# EAGLE design Collection 1 (EAGLE 9.6.2)
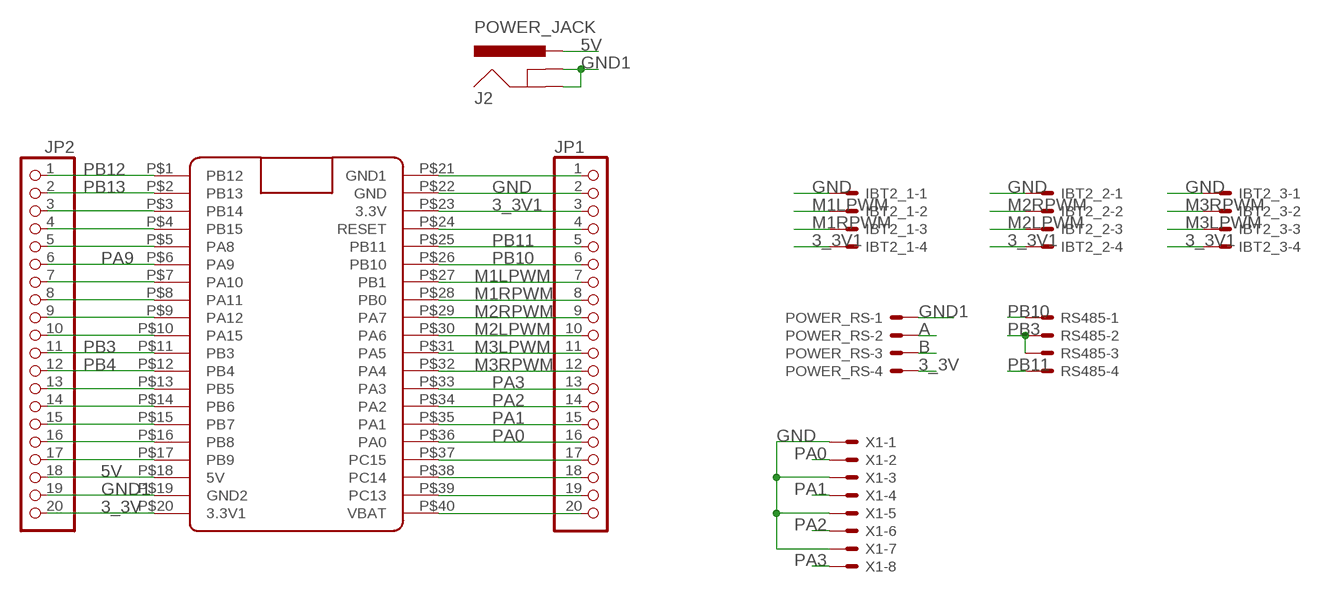
[diagram p0: schematic, sheet 1]

## Parts
IBT2_1  JST-XH-04-PIN-LONG-PAD  [JST-XH-04-PACKAGE-LONG-PAD]
IBT2_2  JST-XH-04-PIN-LONG-PAD  [JST-XH-04-PACKAGE-LONG-PAD]
IBT2_3  JST-XH-04-PIN-LONG-PAD  [JST-XH-04-PACKAGE-LONG-PAD]
J2  POWER_JACK  [POWER_JACK]
JP1  PINHD-1X20  [1X20]
JP2  PINHD-1X20  [1X20]
POWER_RS  JST-XH-04-PIN-LONG-PAD  [JST-XH-04-PACKAGE-LONG-PAD]
RS485  JST-XH-04-PIN-LONG-PAD  [JST-XH-04-PACKAGE-LONG-PAD]
U$1  BLUE_PILL  [BLUE_PILL]
X1  JST-XH-08-PIN-LONG-PAD  [JST-XH-08-PACKAGE-LONG-PAD]

## Nets
3_3V: JP2.20 POWER_RS.4 U$1.P$20(3.3V1)
3_3V1: IBT2_1.4 IBT2_2.4 IBT2_3.4 JP1.3 U$1.P$23(3.3V)
5V: J2.PWR JP2.18 U$1.P$18(5V)
A: POWER_RS.2
B: POWER_RS.3
GND: IBT2_1.1 IBT2_2.1 IBT2_3.1 JP1.2 U$1.P$22(GND) X1.1 X1.3 X1.5 X1.7
GND1: J2.GND J2.GNDBREAK JP2.19 POWER_RS.1 U$1.P$19(GND2)
M1LPWM: IBT2_1.2 JP1.7 U$1.P$27(PB1)
M1RPWM: IBT2_1.3 JP1.8 U$1.P$28(PB0)
M2LPWM: IBT2_2.3 JP1.10 U$1.P$30(PA6)
M2RPWM: IBT2_2.2 JP1.9 U$1.P$29(PA7)
M3LPWM: IBT2_3.3 JP1.11 U$1.P$31(PA5)
M3RPWM: IBT2_3.2 JP1.12 U$1.P$32(PA4)
N$1: JP2.10 U$1.P$10(PA15)
N$2: JP2.7 U$1.P$7(PA10)
N$3: JP2.3 U$1.P$3(PB14)
N$4: JP2.4 U$1.P$4(PB15)
N$5: JP2.5 U$1.P$5(PA8)
N$13: JP2.8 U$1.P$8(PA11)
N$14: JP2.9 U$1.P$9(PA12)
N$18: JP2.13 U$1.P$13(PB5)
N$19: JP2.14 U$1.P$14(PB6)
N$20: JP2.15 U$1.P$15(PB7)
N$21: JP2.16 U$1.P$16(PB8)
N$22: JP2.17 U$1.P$17(PB9)
N$24: JP1.1 U$1.P$21(GND1)
N$29: JP1.4 U$1.P$24(RESET)
N$46: JP1.17 U$1.P$37(PC15)
N$47: JP1.18 U$1.P$38(PC14)
N$48: JP1.19 U$1.P$39(PC13)
N$49: JP1.20 U$1.P$40(VBAT)
PA0: JP1.16 U$1.P$36(PA0) X1.2
PA1: JP1.15 U$1.P$35(PA1) X1.4
PA2: JP1.14 U$1.P$34(PA2) X1.6
PA3: JP1.13 U$1.P$33(PA3) X1.8
PA9: JP2.6 U$1.P$6(PA9)
PB3: JP2.11 RS485.2 RS485.3 U$1.P$11(PB3)
PB4: JP2.12 U$1.P$12(PB4)
PB10: JP1.6 RS485.1 U$1.P$26(PB10)
PB11: JP1.5 RS485.4 U$1.P$25(PB11)
PB12: JP2.1 U$1.P$1(PB12)
PB13: JP2.2 U$1.P$2(PB13)

## Library data of the parts
IBT2_1-IBT2_3 POWER_RS RS485 = JST:JST-XH-04-PIN: JST XH Connector 2 Pin Wire to board connector. Pitch: 2,54 mm, (0.100") Number of pins: 4 Created by Rembrandt Electronics www.rembrandtelectronics.com
J2 = J-Generic-5.5mm-Barrel-Jack:POWER_JACK: Power Jack Connector This is the standard 5.5mm barrel jack for power. The PTH is the most common, proven, reliable, footprint. The Slot footprint only works if the mill layer is transmitted to the PCB fab house so be warned. Here are the connectors we sell at SparkFun: DC Barrel Power Jack/Connector <https://www.sparkfun.com/products/119> (PRT-00119) DC Barrel Power Jack/Connector (SMD) <https://www.sparkfun.com/products/12748> (PRT-12748) DC Barrel Jack Adapter - Breadboard Compatible <https://www.sparkfun.com/products/10811> (PRT-10811) It is used on this SparkFun product (and many, many others): SparkFun RedBoard - Programmed with Arduino <https://www.sparkfun.com/products/12757> (DEV-12757) Also, if you need a mating power supply or connector, please check these out: Wall Adapter Power Supply - 9VDC 650mA <https://www.sparkfun.com/products/298> (TOL-00298) DC Barrel Jack Adapter - Male <https://www.sparkfun.com/products/10287> (PRT-10287); DPN: CP-202A-ND; MPN: PJ-202A
JP1 JP2 = pinhead:PINHD-1X20: PIN HEADER
U$1 = BluePill:BLUE_PILL
X1 = JST:JST-XH-08-PIN: JST XH Connector 2 Pin Wire to board connector. Pitch: 2,54 mm, (0.100") Number of pins: 8 Created by Rembrandt Electronics www.rembrandtelectronics.com

## Net classes
0 default: width 0.3 mm, drill 0.203 mm, clearance 0.3 mm
1 Power: width 1.2 mm, drill 0.305 mm, clearance 0.3 mm

## Board
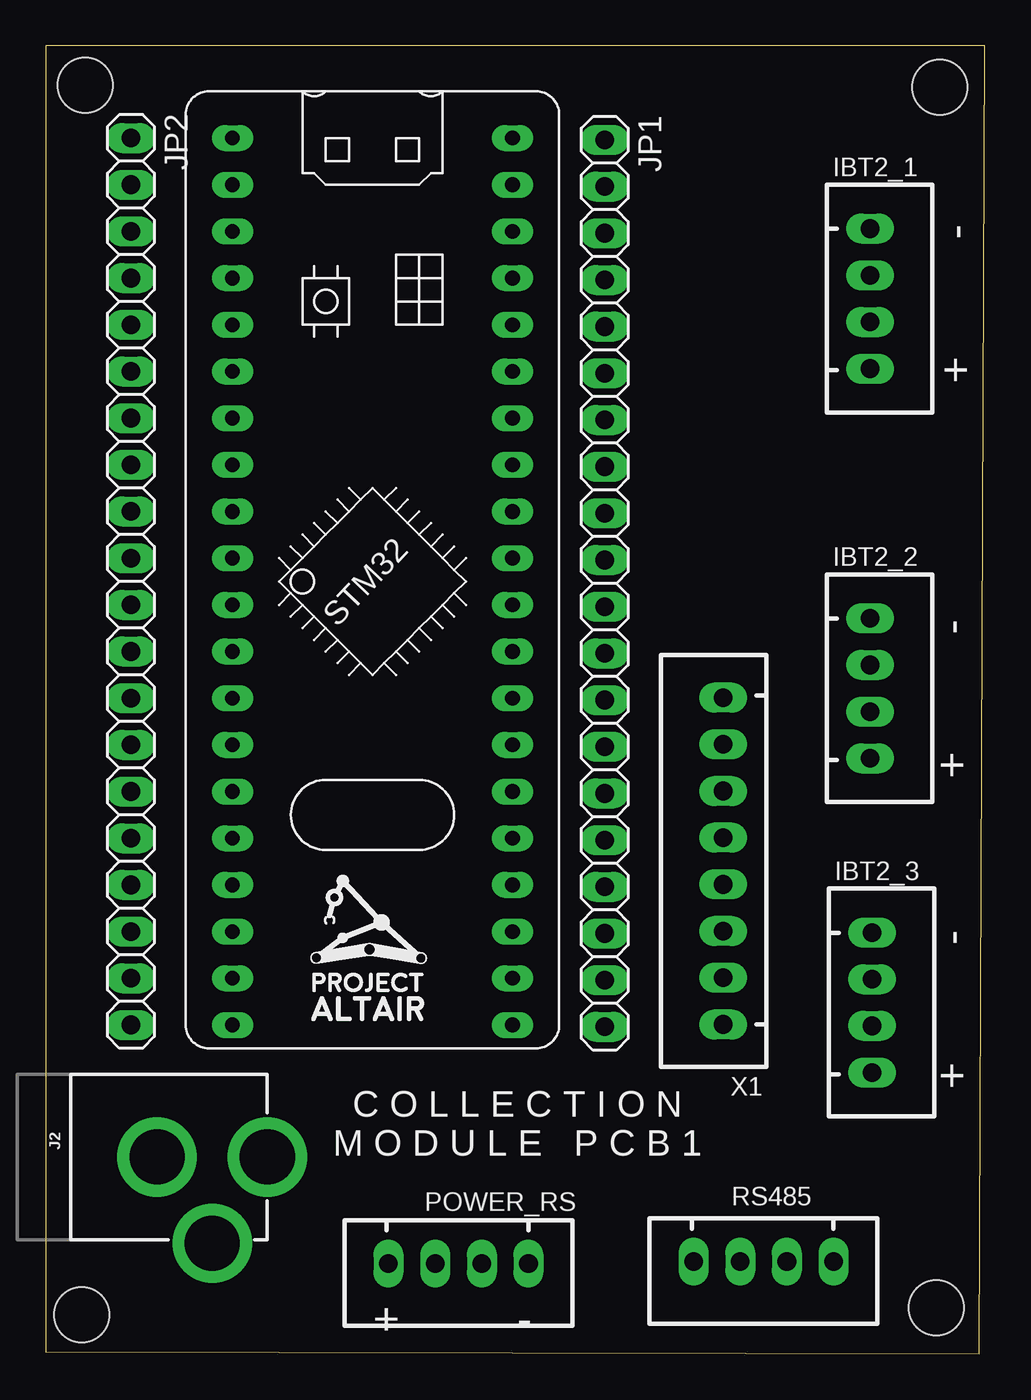
[diagram p1: board, top side]
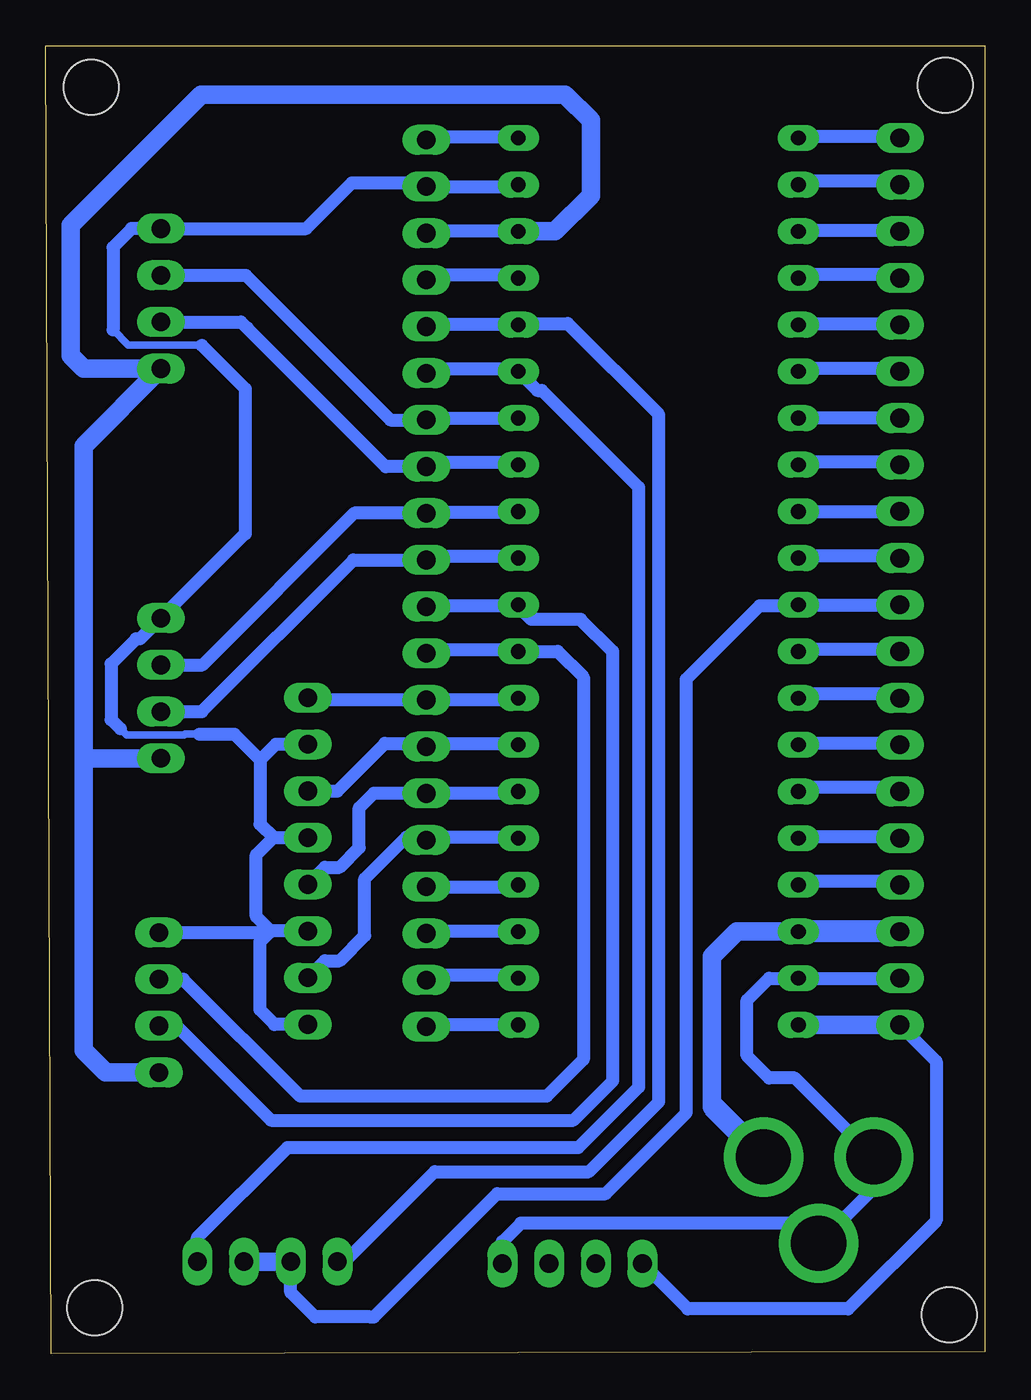
[diagram p2: board, bottom side, seen from below]

Size 51.1 x 71.15 mm. Coordinates in mm from the lower left corner, seen from the top.
Outline: 0,0.1 50.8,0 51.1,71.15 0,71.15 0,0.1
Copper layers (1*16): Top 0.035mm / dielectric 1.5mm / Bottom 0.035mm
Design rules "default *": minimum track width 0.3mm, minimum drill 0.65mm, track to track 0.3mm, track to pad 0.3mm, pad to pad 0.5mm, via to via 0.5mm, smd to smd 30mil, copper to edge 0.7mm, drill to drill 15mil, minimum pad ring 12mil, minimum via ring 15mil, stop-mask expansion 4mil, vias tented up to drill 0mil, thermal gap 10mil
Holes 3 mm at 2.15,69 48.65,68.9 48.45,2.5 1.95,2.1

### Footprints (pad centres in the part's own frame; a part is rotated, then mirrored left to right if it is on the bottom)
JST-XH-04-PACKAGE-LONG-PAD = drill 1.016 long: 1 -3.81,0; 2 -1.27,0; 3 1.27,0; 4 3.81,0
POWER_JACK = drill 2.997 pad 4.318: GND 0,7.7; GNDBREAK 4.7,10.7; PWR 0,13.7
1X20 = drill 1.016 long: 1 -24.13,0; 2 -21.59,0; 3 -19.05,0; 4 -16.51,0; 5 -13.97,0; 6 -11.43,0; 7 -8.89,0; 8 -6.35,0; 9 -3.81,0; 10 -1.27,0; 11 1.27,0; 12 3.81,0; 13 6.35,0; 14 8.89,0; 15 11.43,0; 16 13.97,0; 17 16.51,0; 18 19.05,0; 19 21.59,0; 20 24.13,0
BLUE_PILL = drill 0.8 long: P$1 -7.62,15.24; P$2 -7.62,12.7; P$3 -7.62,10.16; P$4 -7.62,7.62; P$5 -7.62,5.08; P$6 -7.62,2.54; P$7 -7.62,0; P$8 -7.62,-2.54; P$9 -7.62,-5.08; P$10 -7.62,-7.62; P$11 -7.62,-10.16; P$12 -7.62,-12.7; P$13 -7.62,-15.24; P$14 -7.62,-17.78; P$15 -7.62,-20.32; P$16 -7.62,-22.86; P$17 -7.62,-25.4; P$18 -7.62,-27.94; P$19 -7.62,-30.48; P$20 -7.62,-33.02; P$21 7.62,15.24; P$22 7.62,12.7; P$23 7.62,10.16; P$24 7.62,7.62; P$25 7.62,5.08; P$26 7.62,2.54; P$27 7.62,0; P$28 7.62,-2.54; P$29 7.62,-5.08; P$30 7.62,-7.62; P$31 7.62,-10.16; P$32 7.62,-12.7; P$33 7.62,-15.24; P$34 7.62,-17.78; P$35 7.62,-20.32; P$36 7.62,-22.86; P$37 7.62,-25.4; P$38 7.62,-27.94; P$39 7.62,-30.48; P$40 7.62,-33.02
JST-XH-08-PACKAGE-LONG-PAD = drill 1.016 long: 1 -8.89,0; 2 -6.35,0; 3 -3.81,0; 4 -1.27,0; 5 1.27,0; 6 3.81,0; 7 6.35,0; 8 8.89,0

### Placement (x,y rotation side)
IBT2_1  44.85,57.4 270 top
IBT2_2  44.85,36.2 270 top
IBT2_3  44.95,19.1 270 top
J2  -1.65,10.7 270 top
JP1  30.41,41.91 270 top
JP2  4.63,42.01 270 top
POWER_RS  22.45,4.9 180 top
RS485  39.05,5 180 top
U$1  17.77,50.9 0 top
U$3  ALTAIR_SMALL  [ALTAIR_SMALL]  13.85,17.5 0 top
X1  36.85,26.8 90 top

### Tracks (layer width: path | path; a pad name or v marks a point on that pad's centre or on a via)
3_3V
  Bottom 0.7: 4.65,17.9 JP2.20 2.65,15.9 2.65,7.23 7.45,2.43 16.17,2.43 POWER_RS.4
  Bottom 1: U$1.P$20 4.67,17.88 4.65,17.9
3_3V1
  Bottom 0.7: U$1.P$23 25.45,61.1 30.25,61.1 JP1.3
  Bottom 1: U$1.P$23 23.39,61.06 21.45,63 21.45,67.1 22.85,68.5 42.65,68.5 49.75,61.4 49.75,54.3 49.04,53.59 IBT2_1.4 49.05,49.39 49.05,32.7 | 49.05,32.7 49.05,16.5 47.84,15.29 IBT2_3.4 | IBT2_2.4 48.74,32.39 49.05,32.7
5V
  Bottom 1: 14.78,13.43 14.85,13.5 14.85,21.6 13.49,22.96 10.46,22.96
  Bottom 1.2: JP2.18 U$1.P$18 10.46,22.96 | J2.PWR 14.78,13.43
GND
  Bottom 0.4: 47.45,55.7 46.62,54.87 42.62,54.87 | 42.75,33.7 43.53,33.7 43.56,33.67 46.72,33.67 47.05,34
  Bottom 0.7: X1.7 38.6,33.15 39.45,32.3 | 39.45,32.3 39.45,28.8 38.72,28.07 | 38.72,28.07 X1.5 | X1.1 38.66,17.91 39.45,18.7 39.45,22.4 38.94,22.91 | X1.3 38.86,22.99 | 38.86,22.99 39.65,23.78 39.65,27.14 38.72,28.07 | U$1.P$22 25.45,63.5 JP1.2 30.61,63.7 34.45,63.7 36.94,61.21 IBT2_1.1 46.44,61.21 47.45,60.2 47.45,55.7 | 42.62,54.87 40.25,52.5 40.25,44.61 IBT2_2.1 45.98,38.88 46.2,38.88 47.55,37.53 47.55,34.5 47.05,34 | 42.75,33.7 40.85,33.7 39.45,32.3 | IBT2_3.1 38.94,22.91 | 38.94,22.91 38.86,22.99
GND1
  Bottom 0.7: JP2.19 U$1.P$19 11.75,20.42 12.95,19.22 12.95,16.2 11.75,15 10.35,15 J2.GND 6.05,9 J2.GNDBREAK 10.15,7.1 25.25,7.1 26.26,6.09 POWER_RS.1
M1LPWM
  Bottom 0.7: U$1.P$27 30.25,50.9 JP1.7 32.35,50.8 40.22,58.67 IBT2_1.2
M1RPWM
  Bottom 0.7: U$1.P$28 25.45,48.5 30.25,48.5 JP1.8 32.61,48.26 40.15,55.8 40.48,56.13 IBT2_1.3
M2LPWM
  Bottom 0.7: U$1.P$30 25.45,43.4 30.25,43.4 JP1.10 34.37,43.18 42.62,34.93 IBT2_2.3
M2RPWM
  Bottom 0.7: U$1.P$29 25.45,45.8 30.25,45.8 JP1.9 34.33,45.72 42.58,37.47 IBT2_2.2
M3LPWM
  Bottom 0.7: 25.45,40.7 30.25,40.7 JP1.11 | 25.45,40.7 U$1.P$31 | 25.45,40.7 24.7,39.95 22,39.95 20.25,38.2 20.25,14.84 22.4,12.69 38.85,12.69 43.99,17.83 IBT2_3.3
M3RPWM
  Bottom 0.7: JP1.12 30.25,38.3 25.45,38.3 U$1.P$32 23.25,38.2 21.85,36.8 21.85,16 23.85,14 37.25,14 43.62,20.37 IBT2_3.2
N$1
  Bottom 0.7: U$1.P$10 10.15,43.4 4.65,43.4 JP2.10
N$2
  Bottom 0.7: JP2.7 U$1.P$7
N$3
  Bottom 0.7: U$1.P$3 10.15,61.1 4.65,61.1 JP2.3
N$4
  Bottom 0.7: U$1.P$4 10.15,58.7 4.65,58.7 JP2.4
N$5
  Bottom 0.7: U$1.P$5 10.15,56 4.65,56 JP2.5
N$13
  Bottom 0.7: U$1.P$8 10.15,48.5 4.65,48.5 JP2.8
N$14
  Bottom 0.7: U$1.P$9 10.15,45.8 4.65,45.8 JP2.9
N$18
  Bottom 0.7: U$1.P$13 10.15,35.9 4.65,35.9 JP2.13
N$19
  Bottom 0.7: U$1.P$14 10.15,33.2 4.65,33.2 JP2.14
N$20
  Bottom 0.7: U$1.P$15 10.15,30.8 4.65,30.8 JP2.15
N$21
  Bottom 0.7: U$1.P$16 10.15,28.1 4.65,28.1 JP2.16
N$22
  Bottom 0.7: U$1.P$17 10.15,25.7 4.65,25.7 JP2.17
N$24
  Bottom 0.7: U$1.P$21 25.45,66.2 30.25,66.2 JP1.1
N$29
  Bottom 0.7: U$1.P$24 25.45,58.7 30.25,58.7 JP1.4
N$46
  Bottom 0.7: JP1.17 25.45,25.4 U$1.P$37
N$47
  Bottom 0.7: U$1.P$38 25.45,23 30.25,23 JP1.18
N$48
  Bottom 0.7: U$1.P$39 25.45,20.6 30.25,20.6 JP1.19
N$49
  Bottom 0.7: U$1.P$40 25.45,17.9 30.25,17.9 JP1.20
PA0
  Bottom 0.7: 30.25,28.1 25.45,28.1 U$1.P$36 | 30.25,28.1 JP1.16 | X1.2 35.92,21.38 35.12,21.38 33.75,22.75 33.75,25.83 31.48,28.1 30.25,28.1
PA1
  Bottom 0.7: 30.25,30.5 25.45,30.5 U$1.P$35 | 30.25,30.5 JP1.15 | X1.4 35.92,26.46 35.12,26.46 34.05,27.53 34.05,29.7 33.25,30.5 30.25,30.5
PA2
  Bottom 0.7: 30.25,33.2 25.45,33.2 U$1.P$34 | 30.25,33.2 JP1.14 | X1.6 35.24,30.61 32.65,33.2 30.25,33.2
PA3
  Bottom 0.7: U$1.P$33 25.45,35.6 30.25,35.6 JP1.13 36.72,35.56 X1.8
PA9
  Bottom 0.7: U$1.P$6 10.15,53.6 4.65,53.6 JP2.6
PB3
  Bottom 0.7: 10.15,40.7 9.65,40.7 4.65,40.7 JP2.11 | 10.15,40.7 U$1.P$11 | RS485.3 37.78,3.33 36.45,2 33.45,2 33.25,2 26.55,8.7 20.65,8.7 16.25,13.1 16.25,36.7 12.25,40.7 10.15,40.7
  Bottom 1: RS485.3 RS485.2
PB4
  Bottom 0.7: U$1.P$12 10.15,38.3 4.65,38.3 JP2.12
PB10
  Bottom 0.7: JP1.6 30.25,53.6 25.45,53.6 U$1.P$26 24.35,52.4 24.11,52.4 18.85,47.14 18.85,14.5 22.15,11.2 37.96,11.2 42.86,6.3 RS485.1
PB11
  Bottom 0.7: JP1.5 30.25,56 25.45,56 U$1.P$25 25.33,56.04 22.71,56.04 17.75,51.08 17.75,13.7 21.55,9.9 29.94,9.9 34.84,5 RS485.4
PB12
  Bottom 0.7: U$1.P$1 10.15,66.2 4.65,66.2 JP2.1
PB13
  Bottom 0.7: U$1.P$2 10.15,63.8 4.65,63.8 JP2.2

### Text on the board
tNames: + - | + - | C O L L E C T I O N / M O D U L E P C B 1 | + - | + -